# EAGLE design nixie-driver (EAGLE 7.2.0)
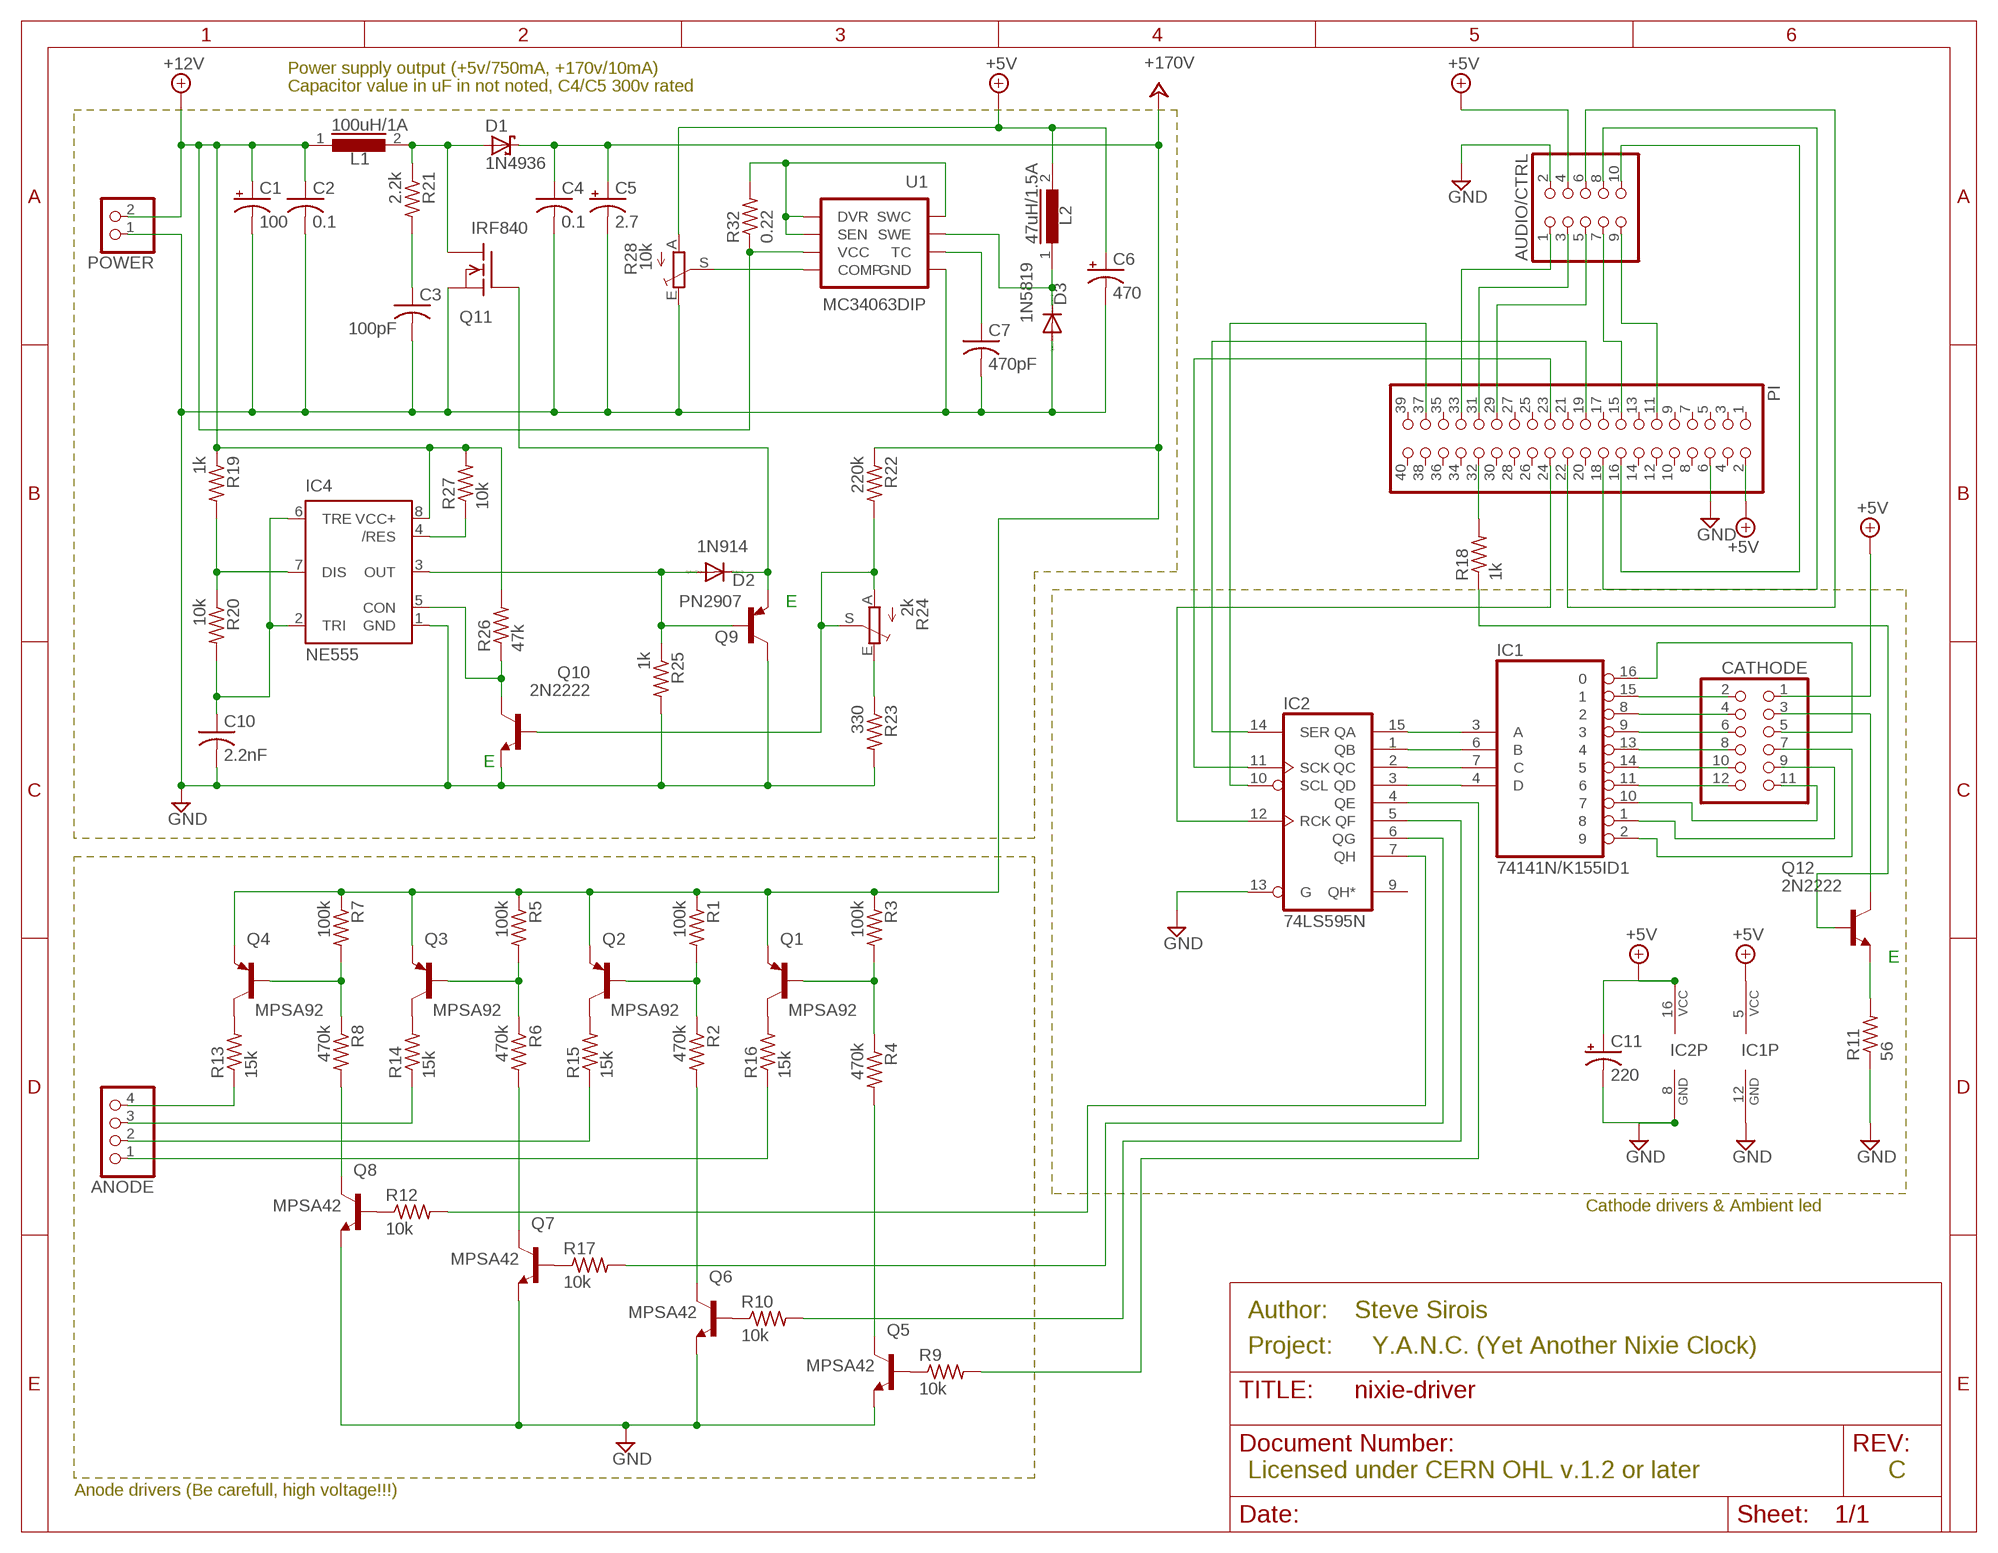
[diagram p0: schematic, sheet 1]

## Parts
ANODE  PINHD-1X4  [1X04]
AUDIO/CTRL  PINHD-2X5  [2X05]
C1  100  CPOL-USE2,5-6E  [E2,5-6E]
C2  0.1  C-US050-024X044  [C050-024X044]
C3  100pF  C-US050-024X044  [C050-024X044]
C4  0.1  C-US150-054X183  [C150-054X183]
C5  2.7  CPOL-USE2.5-7  [E2,5-7]
C6  470  CPOL-USE3.5-8  [E3,5-8]
C7  470pF  C-US050-024X044  [C050-024X044]
C10  2.2nF  C-US025-025X050  [C025-025X050]
C11  220  CPOL-USE3.5-8  [E3,5-8]
CATHODE  PINHD-2X6  [2X06]
D1  1N4936  1N5817-B  [DO41-7.6]
D2  1N914  1N4004  [DO41-10]
D3  1N5819  1N4004  [DO41-10]
IC1  74141N/K155ID1  74141N  [DIL16]
IC2  74LS595N  [DIL16]
IC4  NE555  [DIL-08]
L1  100uH/1A  MMICC7  [MMICC7]
L2  47uH/1.5A  MMICC7  [MMICC7]
PI  PINHD-2X20  [2X20]
POWER  PINHD-1X2  [1X02]
Q1  MPSA92  MPSA92-PNP-TO92-EBC  [TO92-EBC]
Q2  MPSA92  MPSA92-PNP-TO92-EBC  [TO92-EBC]
Q3  MPSA92  MPSA92-PNP-TO92-EBC  [TO92-EBC]
Q4  MPSA92  MPSA92-PNP-TO92-EBC  [TO92-EBC]
Q5  MPSA42  -NPN-TO92-EBC  [TO92-EBC]
Q6  MPSA42  -NPN-TO92-EBC  [TO92-EBC]
Q7  MPSA42  -NPN-TO92-EBC  [TO92-EBC]
Q8  MPSA42  -NPN-TO92-EBC  [TO92-EBC]
Q9  PN2907  2N4126  [TO92-CBE]
Q10  2N2222  2N2222-NPN-TO92-EBC  [TO92-EBC]
Q11  IRF840  [TO220]
Q12  2N2222  2N2222-NPN-TO92-EBC  [TO92-EBC]
R1  100k  R-US_0207/10  [0207/10]
R2  470k  R-US_0207/10  [0207/10]
R3  100k  R-US_0207/10  [0207/10]
R4  470k  R-US_0207/10  [0207/10]
R5  100k  R-US_0207/10  [0207/10]
R6  470k  R-US_0207/10  [0207/10]
R7  100k  R-US_0207/10  [0207/10]
R8  470k  R-US_0207/10  [0207/10]
R9  10k  R-US_0207/10  [0207/10]
R10  10k  R-US_0207/10  [0207/10]
R11  56  R-US_0207/10  [0207/10]
R12  10k  R-US_0207/10  [0207/10]
R13  15k  R-US_0207/10  [0207/10]
R14  15k  R-US_0207/10  [0207/10]
R15  15k  R-US_0207/10  [0207/10]
R16  15k  R-US_0207/10  [0207/10]
R17  10k  R-US_0207/10  [0207/10]
R18  1k  R-US_0207/10  [0207/10]
R19  1k  R-US_0207/10  [0207/10]
R20  10k  R-US_0207/10  [0207/10]
R21  2.2k  R-US_0207/10  [0207/10]
R22  220k  R-US_0207/10  [0207/10]
R23  330  R-US_0207/10  [0207/10]
R24  2k  TRIM_EU-CA6V  [CA6V]
R25  1k  R-US_0207/10  [0207/10]
R26  47k  R-US_0207/10  [0207/10]
R27  10k  R-US_0207/10  [0207/10]
R28  10k  TRIM_EU-CA6V  [CA6V]
R32  0.22  R-US_0204/2V  [0204V]
U1  MC34063DIP  [DIP-08]

## Nets
+5V: AUDIO/CTRL.4 C6.+ C11.+ CATHODE.1 IC1.5(VCC) IC2.16(VCC) L2.2 PI.2 R28.A
+12V: C1.+ C2.1 IC4.8(VCC+) L1.1 POWER.2 R19.1 R26.2 R27.2 R32.1 U1.6(VCC)
+24V: C4.1 C5.+ D1.C Q1.E Q2.E Q3.E Q4.E R1.1 R3.1 R5.1 R7.1 R22.1 ; supply symbol labelled +170V
GND: AUDIO/CTRL.2 C1.- C2.2 C3.2 C4.2 C5.- C6.- C7.2 C10.2 C11.- D3.A IC1.12(GND) IC2.8(GND) IC2.13(G) IC4.1(GND) PI.6 POWER.1 Q5.E Q6.E Q7.E Q8.E Q9.C Q10.E Q11.3(S) R11.1 R23.2 R25.2 R28.E U1.4(GND)
N$1: D1.A L1.2 Q11.2(D) R21.1
N$2: CATHODE.2 IC1.15
N$3: CATHODE.4 IC1.8
N$4: CATHODE.6 IC1.9
N$5: CATHODE.8 IC1.13
N$6: CATHODE.10 IC1.14
N$7: CATHODE.12 IC1.11
N$8: CATHODE.11 IC1.10
N$9: CATHODE.9 IC1.1
N$10: CATHODE.7 IC1.2
N$11: CATHODE.5 IC1.16
N$12: IC1.3(A) IC2.15(QA)
N$13: IC1.6(B) IC2.1(QB)
N$14: IC1.7(C) IC2.2(QC)
N$15: IC1.4(D) IC2.3(QD)
N$16: PI.32 R18.2
N$17: Q4.B R7.2 R8.1
N$18: Q3.B R5.2 R6.1
N$19: Q2.B R1.2 R2.1
N$20: Q1.B R3.2 R4.1
N$21: Q4.C R13.2
N$22: Q3.C R14.2
N$23: Q2.C R15.2
N$24: Q1.C R16.2
N$25: ANODE.4 R13.1
N$26: ANODE.3 R14.1
N$27: ANODE.2 R15.1
N$28: ANODE.1 R16.1
N$29: Q8.C R8.2
N$30: Q8.B R12.1
N$31: Q7.B R17.1
N$32: Q6.B R10.1
N$33: Q5.B R9.1
N$34: Q7.C R6.2
N$35: Q6.C R2.2
N$36: Q5.C R4.2
N$37: IC2.7(QH) R12.2
N$38: IC2.6(QG) R17.2
N$39: IC2.5(QF) R10.2
N$40: IC2.4(QE) R9.2
N$41: IC2.12(RCK) PI.24
N$42: IC2.11(SCK) PI.23
N$43: IC2.14(SER) PI.19
N$44: Q12.E R11.2
N$45: CATHODE.3 Q12.C
N$46: Q12.B R18.1
N$47: AUDIO/CTRL.1 PI.33
N$48: AUDIO/CTRL.3 PI.31
N$49: AUDIO/CTRL.5 PI.29
N$50: AUDIO/CTRL.7 PI.15
N$51: AUDIO/CTRL.9 PI.11
N$52: IC4.7(DIS) R19.2 R20.1
N$53: AUDIO/CTRL.10 PI.16
N$54: AUDIO/CTRL.8 PI.18
N$55: AUDIO/CTRL.6 PI.22
N$56: C3.1 R21.2
N$57: R32.2 U1.1(SWC) U1.7(SEN) U1.8(DVR)
N$58: IC4.4(/RES) R27.1
N$59: D2.A IC4.3(OUT) Q9.B R25.1
N$60: IC4.5(CON) Q10.C R26.1
N$61: R28.S U1.5(COMP)
N$62: D2.C Q9.E Q11.1(G)
N$63: IC2.10(SCL) PI.37
N$64: Q10.B R22.2 R24.A R24.S
N$65: R23.1 R24.E
N$66: C10.1 IC4.2(TRI) IC4.6(TRE) R20.2
N$68: C7.1 U1.3(TC)
N$69: D3.C L2.1 U1.2(SWE)
Unconnected: IC2.9(QH*) PI.1 PI.3 PI.4 PI.5 PI.7 PI.8 PI.9 PI.10 PI.12 PI.13 PI.14 PI.17 PI.20 PI.21 PI.25 PI.26 PI.27 PI.28 PI.30 PI.34 PI.35 PI.36 PI.38 PI.39 PI.40

## Notes on the sheet
- Power supply output (+5v/750mA, +170v/10mA)
- Capacitor value in uF in not noted, C4/C5 300v rated
- E
- E
- E
- Cathode drivers & Ambient led
- Author: | Steve Sirois
- Project: | Y.A.N.C. (Yet Another Nixie Clock)
- Licensed under CERN OHL v.1.2 or later | C
- Anode drivers (Be carefull, high voltage!!!)

## Library data of the parts
ANODE = pinhead:PINHD-1X4: PIN HEADER
AUDIO/CTRL = pinhead:PINHD-2X5: PIN HEADER
C1 C5 C6 C11 = rcl:CPOL-US: POLARIZED CAPACITOR, American symbol
C2-C4 C7 C10 = rcl:C-US: CAPACITOR, American symbol
CATHODE = pinhead:PINHD-2X6: PIN HEADER
D1 = diode:1N581*: 1.0A SCHOTTKY BARRIER RECTIFIER Source: http://www.diodes.com/datasheets/ds23001.pdf
D2 D3 = diode:1N4004: DIODE general purpose rectifier, 1 A
IC1 = 74xx-us:74*141: BCD to decimal DECODER/DRIVER
IC2 = 74xx-us:74*595: 8-bit SHIFT REGISTER, output latch
IC4 = st-microelectronics:NE555: General purpose bipolar Timer; MF: Arrow Electronics; MPN: NE555N; OC_FARNELL: 1467742; OC_NEWARK: 89K1486
L1 L2 = inductors:MMICC7: INDUCTOR
PI = pinhead:PINHD-2X20: PIN HEADER
POWER = pinhead:PINHD-1X2: PIN HEADER
Q1-Q4 = transistor:*-PNP-: PNP Transistror
Q5-Q8 = transistor:*-NPN-: NPN Transistror BF959 corrected 2008.03.06
Q9 = transistor-pnp:2N4126*: PNP Transistror
Q10 Q12 = transistor-neu-to92:*-NPN-: NPN Transistror BF959 corrected 2008.03.06
Q11 = transistor-fet:IRF840: N-Channel Enhancement MOSFET (HEXFET); 500V; 8A; 0,85Ohm
R1-R23 R25-R27 R32 = resistor:R-US_: RESISTOR, American symbol
R24 R28 = pot:TRIM_EU-: POTENTIOMETER
U1 = SparkFun-PowerIC:MC34063: Jellybean switching supply controller

## Board
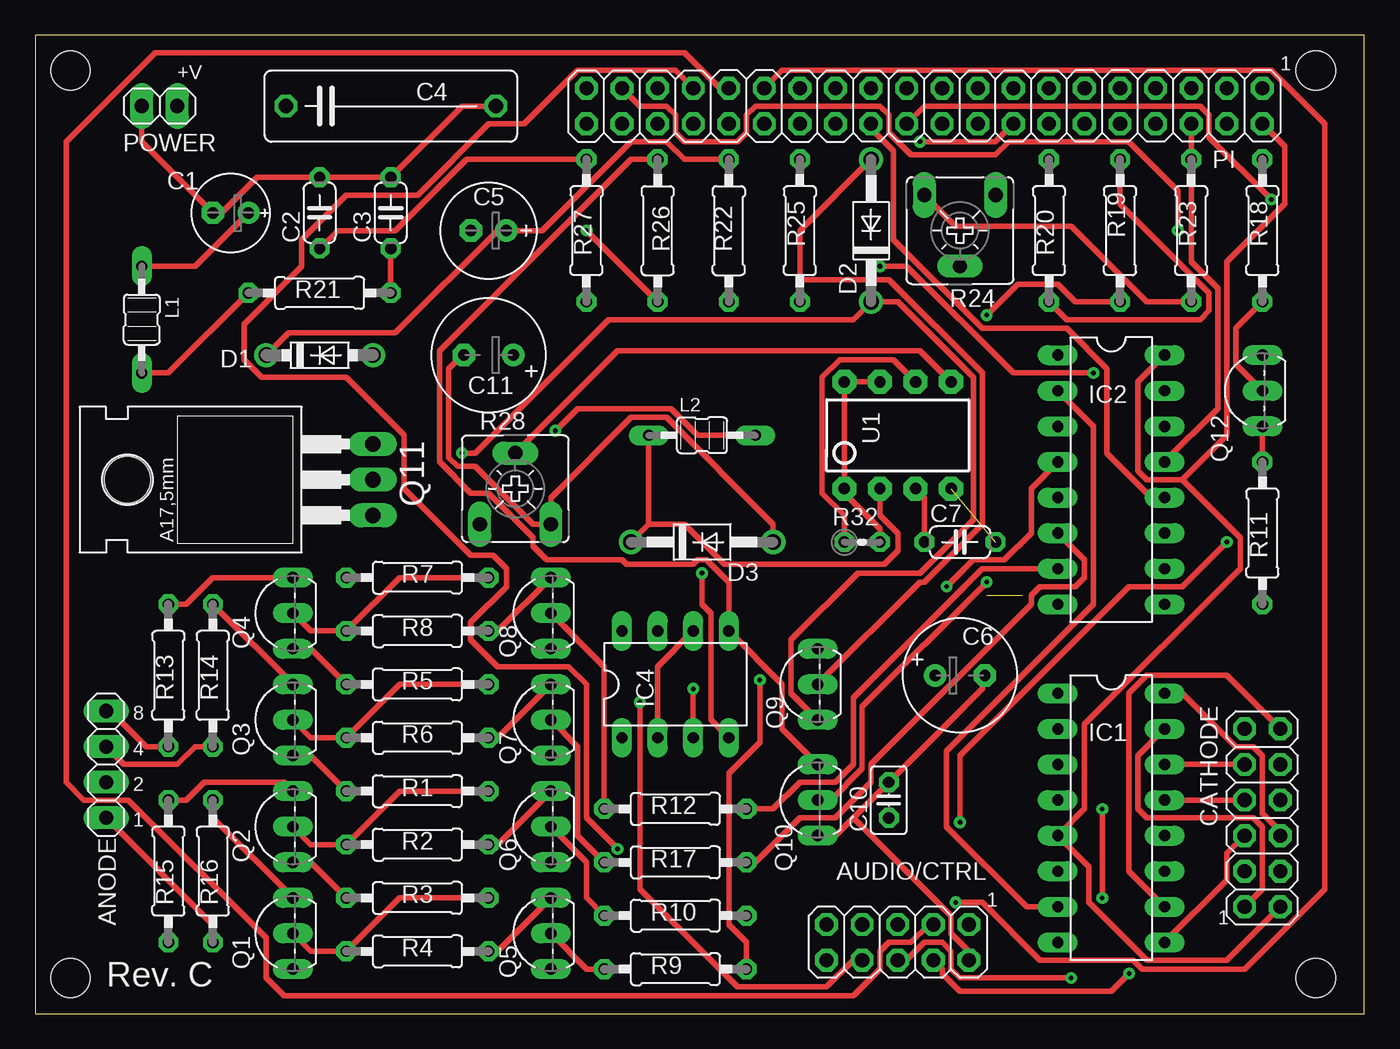
[diagram p1: board, top side]
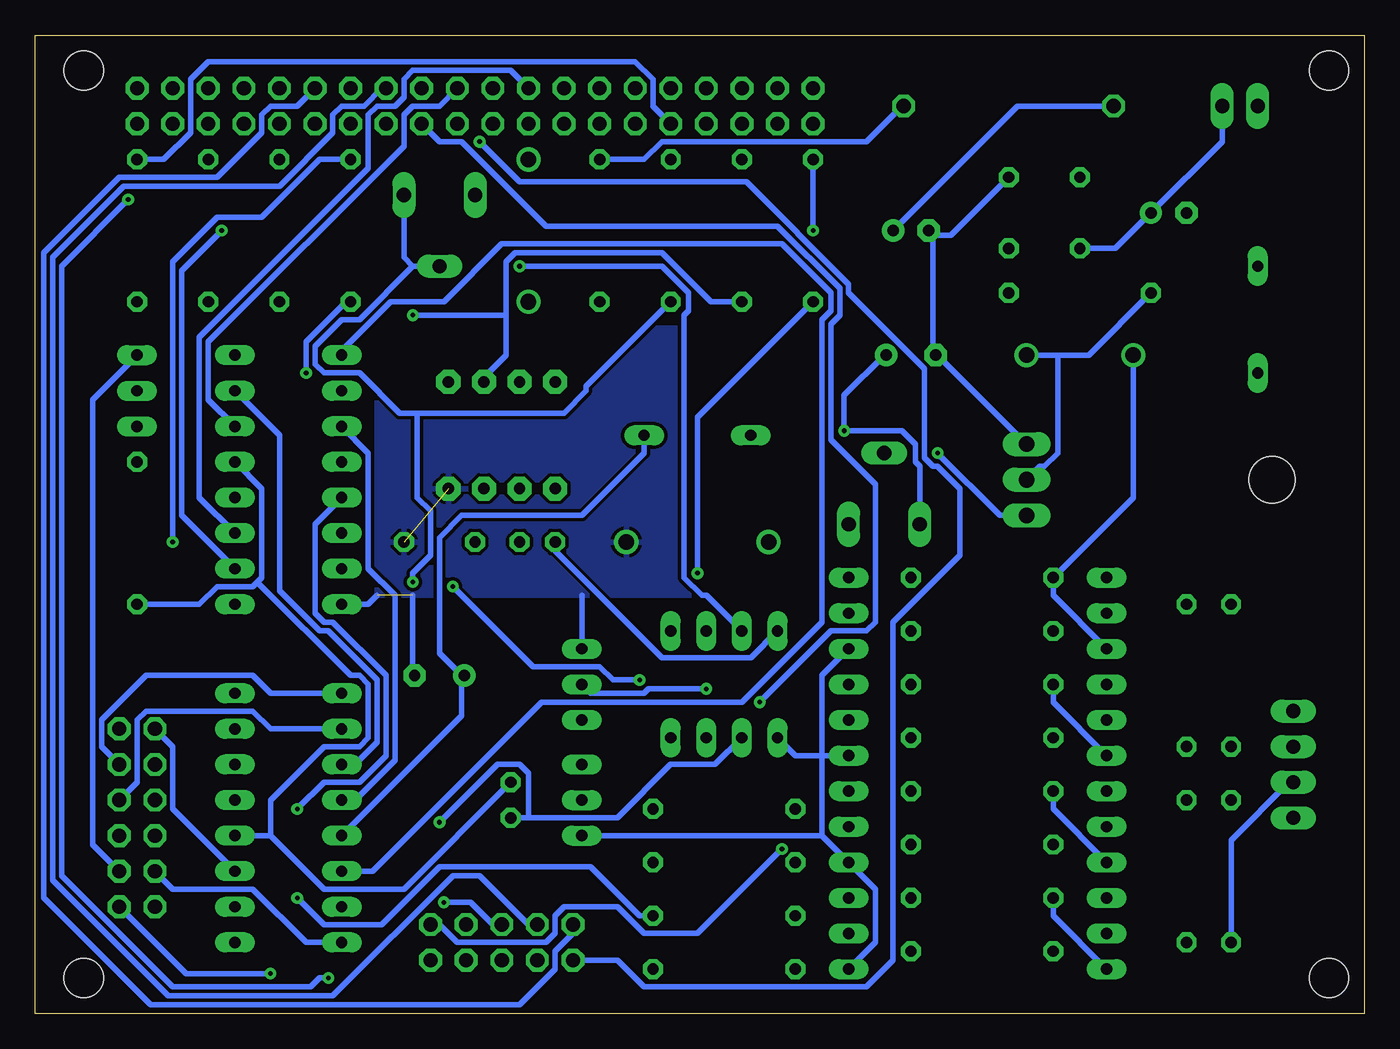
[diagram p2: board, bottom side, seen from below]

Size 94.92 x 69.84 mm. Coordinates in mm from the lower left corner, seen from the top.
Outline: 0,0 94.92,0 94.92,69.84 0,69.84 0,0
Copper layers (1*16): Top 0.0356mm / dielectric 1.5011mm / Bottom 0.0356mm
Design rules "osh *": minimum track width 15mil, minimum drill 13mil, track to track 10mil, track to pad 10mil, pad to pad 6mil, via to via 6mil, smd to smd 6mil, copper to edge 15mil, drill to drill 6mil, minimum pad ring 12mil, minimum via ring 10mil, stop-mask expansion 3mil, vias tented up to drill 0mil, thermal gap 10mil
Holes 2.8 mm at 91.44,2.54 2.54,2.54 91.44,67.31 2.54,67.31
tRestrict: area 2.5,33 to 19.1,43.2

### Footprints (pad centres in the part's own frame; a part is rotated, then mirrored left to right if it is on the bottom)
1X04 = drill 1.016 long: 1 -3.81,0; 2 -1.27,0; 3 1.27,0; 4 3.81,0
2X05 = drill 1.016 octagon: 1 -5.08,-1.27; 2 -5.08,1.27; 3 -2.54,-1.27; 4 -2.54,1.27; 5 0,-1.27; 6 0,1.27; 7 2.54,-1.27; 8 2.54,1.27; 9 5.08,-1.27; 10 5.08,1.27
E2,5-6E = drill 0.813 pad 1.575: + -1.27,0 | drill 0.813 pad 1.575 octagon: - 1.27,0
C050-024X044 = drill 0.813 octagon: 1 -2.54,0; 2 2.54,0
C150-054X183 = drill 1.016 octagon: 1 -7.493,0; 2 7.493,0
E2,5-7 = drill 0.813 pad 1.6: + -1.27,0 | drill 0.813 pad 1.6 octagon: - 1.27,0
E3,5-8 = drill 0.813 pad 1.6: + -1.778,0 | drill 0.813 pad 1.6 octagon: - 1.778,0
C025-025X050 = drill 0.813 octagon: 1 -1.27,0; 2 1.27,0
2X06 = drill 1.016 octagon: 1 -6.35,-1.27; 2 -6.35,1.27; 3 -3.81,-1.27; 4 -3.81,1.27; 5 -1.27,-1.27; 6 -1.27,1.27; 7 1.27,-1.27; 8 1.27,1.27; 9 3.81,-1.27; 10 3.81,1.27; 11 6.35,-1.27; 12 6.35,1.27
DO41-7.6 = drill 1.1 pad 1.7: A 3.81,0; C -3.81,0
DO41-10 = drill 1.118: A 5.08,0; C -5.08,0
DIL16 = drill 0.813 long: 1 -8.89,-3.81; 2 -6.35,-3.81; 3 -3.81,-3.81; 4 -1.27,-3.81; 5 1.27,-3.81; 6 3.81,-3.81; 7 6.35,-3.81; 8 8.89,-3.81; 9 8.89,3.81; 10 6.35,3.81; 11 3.81,3.81; 12 1.27,3.81; 13 -1.27,3.81; 14 -3.81,3.81; 15 -6.35,3.81; 16 -8.89,3.81
DIL-08 = drill 0.813 long: 1 -3.81,-3.81; 2 -1.27,-3.81; 3 1.27,-3.81; 4 3.81,-3.81; 5 3.81,3.81; 6 1.27,3.81; 7 -1.27,3.81; 8 -3.81,3.81
MMICC7 = drill 0.813 long: 1 -3.81,0; 2 3.81,0
2X20 = drill 1.016 octagon: 1 -24.13,-1.27; 2 -24.13,1.27; 3 -21.59,-1.27; 4 -21.59,1.27; 5 -19.05,-1.27; 6 -19.05,1.27; 7 -16.51,-1.27; 8 -16.51,1.27; 9 -13.97,-1.27; 10 -13.97,1.27; 11 -11.43,-1.27; 12 -11.43,1.27; 13 -8.89,-1.27; 14 -8.89,1.27; 15 -6.35,-1.27; 16 -6.35,1.27; 17 -3.81,-1.27; 18 -3.81,1.27; 19 -1.27,-1.27; 20 -1.27,1.27; 21 1.27,-1.27; 22 1.27,1.27; 23 3.81,-1.27; 24 3.81,1.27; 25 6.35,-1.27; 26 6.35,1.27; 27 8.89,-1.27; 28 8.89,1.27; 29 11.43,-1.27; 30 11.43,1.27; 31 13.97,-1.27; 32 13.97,1.27; 33 16.51,-1.27; 34 16.51,1.27; 35 19.05,-1.27; 36 19.05,1.27; 37 21.59,-1.27; 38 21.59,1.27; 39 24.13,-1.27; 40 24.13,1.27
1X02 = drill 1.016 long: 1 -1.27,0; 2 1.27,0
TO92-EBC = drill 0.813 long: B 0,-1.27; C 2.54,-1.27; E -2.54,-1.27
TO92-CBE = drill 0.813 long: B 0,0; C 2.54,0; E -2.54,0
TO220 = drill 1.118 long: 1 -2.54,-6.35; 2 0,-6.35; 3 2.54,-6.35 | hole 3.302: 0,11.176
0207/10 = drill 0.813 octagon: 1 -5.08,0; 2 5.08,0
CA6V = drill 1.016 long: A -2.54,-2.54; E 2.54,-2.54; S 0,2.54
0204V = drill 0.813 octagon: 1 -1.27,0; 2 1.27,0
DIP-08 = drill 0.813 pad 1.727 octagon: 1 -3.81,-3.81; 2 -1.27,-3.81; 3 1.27,-3.81; 4 3.81,-3.81; 5 3.81,3.81; 6 1.27,3.81; 7 -1.27,3.81; 8 -3.81,3.81

### Placement (x,y rotation side)
ANODE  5.08,17.78 90 top
AUDIO/CTRL  61.59,5.08 180 top
C1  13.97,57.15 180 top
C2  20.32,57.15 90 top
C3  25.4,57.15 90 top
C4  25.4,64.77 0 top
C5  32.38,55.88 180 top
C6  66.04,24.13 0 top
C7  66.04,33.66 0 top
C10  60.96,15.24 90 top
C11  32.38,46.99 180 top
CATHODE  87.63,13.97 90 top
D1  20.32,46.99 0 top
D2  59.69,55.88 90 top
D3  47.62,33.66 0 top
IC1  76.83,13.97 270 top
IC2  76.83,38.1 270 top
IC4  45.72,23.5 0 top
L1  7.62,49.53 270 top
L2  47.62,41.27 0 top
PI  63.5,64.77 180 top
POWER  8.89,64.77 0 top
Q1  17.14,5.71 90 top
Q2  17.14,13.34 90 top
Q3  17.14,20.95 90 top
Q4  17.14,28.57 90 top
Q5  35.56,5.71 90 top
Q6  35.56,13.34 90 top
Q7  35.56,20.95 90 top
Q8  35.56,28.57 90 top
Q9  55.88,23.5 90 top
Q10  54.61,15.24 90 top
Q11  17.78,38.1 90 top
Q12  86.36,44.45 90 top
R1  27.3,15.88 0 top
R2  27.3,12.06 0 top
R3  27.3,8.26 0 top
R4  27.3,4.45 0 top
R5  27.3,23.5 0 top
R6  27.3,19.68 0 top
R7  27.3,31.11 0 top
R8  27.3,27.3 0 top
R9  45.72,3.17 0 top
R10  45.72,6.99 0 top
R11  87.63,34.29 90 top
R12  45.72,14.61 0 top
R13  9.53,24.13 90 top
R14  12.7,24.13 90 top
R15  9.53,10.16 90 top
R16  12.7,10.16 90 top
R17  45.72,10.79 0 top
R18  87.63,55.88 90 top
R19  77.47,55.88 90 top
R20  72.39,55.88 90 top
R21  20.32,51.44 0 top
R22  49.53,55.88 270 top
R23  82.55,55.88 90 top
R24  66.04,55.88 180 top
R25  54.61,55.88 90 top
R26  44.45,55.88 270 top
R27  39.37,55.88 90 top
R28  34.29,37.47 0 top
R32  59.05,33.66 0 top
U1  61.59,41.27 0 top

### Tracks (layer width: path | path; a pad name or v marks a point on that pad's centre or on a via)
+5V  (via drill 0.33)
  Top 0.381: L2.2 47.31,41.27 45.4,43.18 38.73,43.18 v37.15,41.59 | IC2.16 78.74,45.09 78.74,38.73 79.38,38.1 81.92,38.1 | 81.92,38.1 85.09,41.27 85.09,53.66 89.22,57.78 89.22,61.91 PI.2 | AUDIO/CTRL.4 64.77,3.17 64.77,2.86 66.04,1.59 76.83,1.59 v78.11,2.86 | CATHODE.1 85.09,3.81 79.38,3.81 75.25,7.94 75.25,10.48 IC1.5 74.93,14.61 74.93,20.64 86.04,31.75 86.04,33.97 81.92,38.1
  Bottom 0.381: C11.+ 34.29,46.99 37.15,44.13 v37.15,41.59 33.02,41.59 32.07,40.64 32.07,39.37 31.75,39.05 R28.A | IC1.5 64.45,21.27 64.45,24.13 | v78.11,2.86 84.14,2.86 CATHODE.1 | L2.2 51.44,40.01 55.88,35.56 64.45,35.56 66.04,33.97 66.04,25.72 64.45,24.13 | 64.45,24.13 C6.+
+12V  (via drill 0.33)
  Top 0.381: L1.1 11.43,53.34 C1.+ | R27.2 30.8,60.96 25.72,55.88 21.59,55.88 C2.1 | R19.1 74.3,50.8 73.03,52.07 70.17,52.07 v67.94,49.85 | R32.1 57.78,35.56 56.2,37.15 56.2,45.4 57.47,46.67 61.28,46.67 U1.6 | R26.2 v39.37,55.88
  Bottom 0.381: C2.1 17.78,54.61 C1.+ 10.16,62.23 POWER.2 | IC4.8 43.81,25.4 50.16,25.4 57.78,33.02 R32.1 | R26.2 46.67,50.8 50.16,54.29 60.64,54.29 61.28,53.66 61.28,49.85 | 61.28,49.85 61.28,46.99 62.87,45.4 U1.6 | 61.28,49.85 v67.94,49.85 | v39.37,55.88 R27.2
+24V
  Top 0.381: R22.1 46.35,60.96 45.09,62.23 42.55,62.23 36.2,55.88 C5.+ 33.02,55.88 25.72,48.58 18.1,48.58 D1.C | Q3.E 19.68,18.41 R1.1 | Q2.E 19.68,10.79 R3.1 | Q4.E 19.68,26.04 R5.1
  Bottom 0.381: C4.1 24.77,64.77 C5.+ | Q1.E 22.23,6.99 R3.1 | R1.1 22.23,14.61 Q2.E | Q4.E 22.23,29.84 R7.1 16.51,36.83 D1.C | Q3.E 22.23,22.23 R5.1
GND  (2 unrouted)
  Top 0.381: C11.- 30.48,46.99 29.53,46.04 29.53,39.69 30.16,39.05 31.43,39.05 35.56,34.92 R28.E 36.83,36.83 42.55,42.55 45.09,42.55 52.7,34.92 D3.A | POWER.1 7.62,62.23 C1.- 13.34,57.15 15.88,59.69 C2.2 C3.2 30.48,64.77 C4.2 | PI.6 R23.2 82.55,53.66 84.45,51.75 84.45,43.18 IC2.13 | Q10.E 57.15,12.7 58.42,13.97 | 58.42,13.97 C10.2 67.63,23.18 67.63,24.13 C6.- | AUDIO/CTRL.2 66.67,4.45 65.41,5.71 65.41,6.99 58.42,13.97
  Bottom 0.381: 30.8,55.56 30.8,46.99 C11.- 30.48,46.99 Q11.3 | R25.2 51.44,60.96 50.16,62.23 35.56,62.23 33.02,64.77 C4.2 | 30.8,55.56 29.53,55.56 C3.2 | 30.8,55.56 C5.- | R11.1 83.19,29.21 81.92,30.48 79.38,30.48 79.06,30.8 | 79.06,30.8 78.74,31.11 78.74,37.47 IC2.13 | Q5.E 34.92,5.08 34.92,8.89 Q6.E 38.73,12.7 | 38.73,18.41 40.64,18.41 IC4.1 | 38.73,18.41 Q7.E | Q8.E 38.73,24.13 38.73,18.41 | 38.73,18.41 38.73,12.7 | 55.88,29.84 Q9.C | IC2.8 71.12,29.21 70.48,29.84 | 67.94,29.84 67.94,24.13 C6.- | 78.11,12.7 IC1.12 | 78.11,12.7 74.3,8.89 68.58,8.89 C10.2 | Q10.E 38.73,12.7 | 79.06,30.8 72.39,24.13 71.75,24.13 71.12,23.5 71.12,19.68 71.75,19.05 74.3,19.05 78.11,15.24 78.11,12.7
  pour Bottom: 40.01,48.9 70.48,48.9 70.48,29.84 40.01,29.84
N$1
  Top 0.381: L1.2 9.53,45.72 R21.1
  Bottom 0.381: 21.91,46.99 19.68,46.99 R21.1 | 21.91,46.99 D1.A | Q11.2 23.18,39.05 22.86,39.05 21.91,40.01 21.91,46.99
N$2
  Top 0.381: IC1.15 78.74,18.41 78.74,14.61 79.38,13.97 87,13.97 87.63,13.34 87.63,8.89 CATHODE.2
N$3
  Bottom 0.381: IC1.8 75.56,5.08 79.38,8.89 85.09,8.89 CATHODE.4
N$4
  Top 0.381: IC1.9 85.09,9.53 85.09,11.43 CATHODE.6
N$5
  Top 0.381: CATHODE.8 IC1.13
N$6
  Top 0.381: CATHODE.10 IC1.14
N$7
  Bottom 0.381: IC1.11 85.09,14.61 85.09,19.05 CATHODE.12
N$8
  Top 0.381: IC1.10 78.11,10.16 78.11,22.86 79.38,24.13 85.09,24.13 CATHODE.11
N$9
  Bottom 0.381: IC1.1 78.11,22.86 79.38,24.13 87,24.13 90.17,20.95 90.17,19.05 CATHODE.9
N$10
  Bottom 0.381: IC1.2 78.11,20.32 79.38,21.59 87,21.59 87.63,20.95 87.63,16.51 CATHODE.7
N$11
  Top 0.381: IC1.16 81.92,22.86 85.72,19.05 87,19.05 87.63,18.41 87.63,14.29 88.9,13.02 CATHODE.5
N$12
  Bottom 0.381: IC1.3 72.07,17.78 70.48,19.37 70.48,23.81 73.98,27.3 74.61,27.3 77.47,30.16 77.47,41.27 IC2.15
N$13
  Bottom 0.381: IC1.6 70.8,10.16 58.74,22.23 44.45,22.23 38.73,27.94 38.73,49.53 38.1,50.16 38.1,51.44 41.59,54.93 61.59,54.93 65.72,50.8 69.53,50.8 73.03,47.31 IC2.1
N$14
  Top 0.381: IC1.7 70.8,7.62 65.09,13.34 65.09,18.73 75.56,29.21 75.56,41.91 IC2.2
N$15
  Bottom 0.381: IC1.4 72.07,15.24 69.22,18.1 69.22,29.84 71.12,31.75 71.12,40.01 IC2.3
N$16
  Bottom 0.381: R18.2 85.72,60.96 83.82,62.87 83.82,66.67 82.55,67.94 52.07,67.94 50.8,66.67 50.8,64.77 PI.32
N$17
  Top 0.381: Q4.B 19.68,27.3 R8.1 26.04,31.11 R7.2
N$18
  Top 0.381: Q3.B 19.68,19.68 R6.1 26.04,23.5 R5.2
N$19
  Top 0.381: Q2.B 19.68,12.06 R2.1 26.04,15.88 R1.2
N$20
  Top 0.381: Q1.B 19.68,4.45 R4.1 26.04,8.26 R3.2
N$21
  Top 0.381: R13.2 10.79,29.21 12.7,31.11 Q4.C
N$22
  Top 0.381: Q3.C R14.2
N$23
  Top 0.381: R15.2 10.79,15.24 12.06,16.51 17.78,16.51 Q2.C
N$24
  Top 0.381: R16.2 12.7,13.97 Q1.C
N$25
  Top 0.381: R13.1 7.94,19.05 5.4,21.59 ANODE.4
N$26
  Top 0.381: R14.1 11.43,19.05 10.16,17.78 6.35,17.78 ANODE.3
N$27
  Bottom 0.381: R15.1 9.53,12.38 5.4,16.51 ANODE.2
N$28
  Top 0.381: R16.1 12.7,6.35 ANODE.1
N$29
  Top 0.381: R8.2 33.02,27.3 Q8.C
N$30
  Top 0.381: Q8.B 40.64,24.77 R12.1
N$31
  Top 0.381: Q7.B 38.73,19.05 38.73,12.7 R17.1
N$32
  Top 0.381: Q6.B 39.37,10.79 39.37,8.26 R10.1
N$33
  Top 0.381: R9.1 39.37,3.17 Q5.B
N$34
  Top 0.381: R6.2 33.02,19.68 Q7.C
N$35
  Top 0.381: R2.2 33.02,12.06 Q6.C
N$36
  Top 0.381: R4.2 33.02,4.45 Q5.C
N$37
  Top 0.381: R12.2 52.7,14.61 54.61,16.51 57.15,16.51 58.42,17.78 58.42,22.54 67.63,31.75 IC2.7
N$38
  Top 0.381: R17.2 51.44,10.79 54.61,13.97 57.15,13.97 59.69,16.51 59.69,17.78 71.12,29.21 71.12,29.84 71.75,30.48 74.3,30.48 74.93,31.11 74.93,32.38 IC2.6
N$39  (via drill 0.33)
  Top 0.381: v76.2,14.61 v76.2,8.26
  Bottom 0.381: R10.2 51.75,6.99 55.24,10.48 66.04,10.48 70.17,6.35 74.3,6.35 v76.2,8.26 | v76.2,14.61 74.3,16.51 71.75,16.51 69.85,18.41 69.85,24.13 73.66,27.94 74.3,27.94 74.93,28.57 74.93,34.92 IC2.5
N$40  (via drill 0.33)
  Top 0.381: R9.2 50.8,5.08 49.53,6.35 49.53,17.14 51.75,19.37 v51.75,23.81 | v65.09,30.48 66.99,32.38 69.22,32.38 71.12,34.29 71.12,37.47 IC2.4
  Bottom 0.381: v51.75,23.81 53.66,23.81 54.61,24.77 59.37,24.77 v65.09,30.48
N$41
  Top 0.381: IC2.12 79.69,36.83 76.52,40.01 76.52,46.04 73.66,48.9 67.63,48.9 61.28,55.24 61.28,61.59 59.69,63.18 PI.24
N$42
  Bottom 0.381: IC2.11 83.19,36.83 83.19,48.26 71.12,60.33 71.12,64.14 70.48,64.77 69.22,64.77 68.58,65.41 68.58,66.67 67.94,67.31 60.96,67.31 PI.23
N$43
  Bottom 0.381: IC2.14 82.55,43.81 82.55,47.94 68.58,61.91 68.58,64.14 67.94,64.77 66.04,64.77 PI.19
N$44
  Top 0.381: Q12.E R11.2
N$45
  Bottom 0.381: Q12.C 90.81,43.81 90.81,12.06 CATHODE.3
N$46
  Top 0.381: Q12.B 85.72,46.35 85.72,48.9 R18.1
N$47  (via drill 0.33)
  Top 0.381: v41.59,11.75 39.37,13.97 39.37,23.5 38.1,24.77 33.02,24.77 31.11,26.67 31.11,27.94 33.66,30.48 33.66,31.75 32.7,32.7 31.11,32.7 26.35,37.47 26.35,41.27 22.23,45.4 16.19,45.4 14.92,46.67 14.92,49.21 19.05,53.34 19.05,55.24 22.23,58.42 27.3,58.42 32.38,63.5 34.92,63.5 38.73,67.31 45.72,67.31 PI.33
  Bottom 0.381: AUDIO/CTRL.1 66.04,6.35 64.77,5.08 58.42,5.08 57.78,5.71 57.78,6.99 57.15,7.62 53.34,7.62 51.44,5.71 47.62,5.71 v41.59,11.75
N$48
  Top 0.381: PI.31 48.9,66.04 46.35,68.58 8.57,68.58 2.22,62.23 2.22,16.51 3.49,15.24 6.67,15.24 16.51,5.4 16.51,2.54 17.78,1.27 58.42,1.27 60.33,3.17 60.33,4.45 60.96,5.08 62.55,5.08 63.82,6.35 AUDIO/CTRL.3
N$49  (via drill 0.33)
  Top 0.381: v65.72,7.94 67.63,7.94 71.75,3.81 78.42,3.81 79.06,3.17 86.36,3.17 92.08,8.89 92.08,63.5 88.27,67.31 53.34,67.31 PI.29
  Bottom 0.381: AUDIO/CTRL.5 62.23,6.35 63.82,7.94 v65.72,7.94
N$50
  Bottom 0.381: AUDIO/CTRL.7 59.69,6.35 63.18,9.84 65.09,9.84 73.66,1.27 85.41,1.27 93.66,9.53 93.66,53.98 88.58,59.05 77.47,59.05 73.66,62.87 73.66,64.14 73.03,64.77 71.44,64.77 70.17,66.04 PI.15
N$51
  Bottom 0.381: AUDIO/CTRL.9 56.52,5.71 57.78,4.45 57.78,3.17 60.33,0.64 86.68,0.64 94.3,8.26 94.3,54.29 88.9,59.69 81.92,59.69 78.74,62.87 78.74,64.14 78.11,64.77 76.2,64.77 PI.11
N$52  (via drill 0.33)
  Top 0.381: v60.33,53.34 62.23,53.34 69.85,45.72 v75.56,45.72 | R19.2 77.47,57.78 83.82,51.44 83.82,50.16 83.19,49.53 73.66,49.53 R20.1
  Bottom 0.381: IC4.7 46.99,29.84 47.31,29.84 48.58,31.11 48.58,49.85 48.26,50.16 48.26,51.44 50.16,53.34 v60.33,53.34 | v75.56,45.72 75.56,47.94 72.71,50.8 R20.1
N$53  (via drill 0.33)
  Top 0.381: v63.18,62.23 68.58,62.23 PI.16
  Bottom 0.381: AUDIO/CTRL.10 53.34,3.81 51.44,1.91 35.56,1.91 33.66,3.81 33.66,27.94 28.89,32.7 28.89,37.47 30.48,39.05 30.8,39.05 31.43,39.69 31.43,46.04 36.83,51.44 36.83,52.07 44.13,59.37 60.33,59.37 v63.18,62.23
N$54  (via drill 0.33)
  Top 0.381: AUDIO/CTRL.8 58.42,3.81 56.52,1.91 50.16,1.91 43.18,8.89 v43.18,22.23
  Bottom 0.381: v43.18,22.23 38.1,27.3 35.56,27.3 34.92,27.94 34.92,37.78 38.1,40.96 38.1,49.21 37.47,49.85 37.47,51.75 41.91,56.2 58.42,56.2 64.45,62.23 66.04,62.23 PI.18
N$55  (via drill 0.33)
  Top 0.381: AUDIO/CTRL.6 62.23,3.81 63.5,5.08 64.77,5.08 65.41,4.45 65.41,3.17 66.04,2.54 v73.98,2.54 | v88.27,58.1 83.82,62.55 83.82,64.14 83.19,64.77 63.5,64.77 PI.22
  Bottom 0.381: v73.98,2.54 74.61,2.54 75.25,1.91 85.09,1.91 93.03,9.84 93.03,53.34 v88.27,58.1
N$56
  Top 0.381: C3.1 R21.2
N$57
  Top 0.381: U1.7 U1.8 U1.1 57.78,37.15 60.33,34.61 R32.2
N$58  (via drill 0.33)
  Top 0.381: v47.62,31.43 47.62,29.21 48.26,28.57 48.26,20.95 IC4.4
  Bottom 0.381: R27.1 47.62,42.55 v47.62,31.43
N$59  (via drill 0.33)
  Top 0.381: v46.99,23.18 IC4.3 | 54.61,52.39 54.61,55.88 D2.A | 54.61,52.39 R25.1 | Q9.B 63.18,30.8 63.5,30.8 67.63,34.92 67.63,45.72 60.96,52.39 54.61,52.39
  Bottom 0.381: v46.99,23.18 51.12,23.18 51.44,22.86 55.24,22.86 Q9.B
N$60
  Top 0.381: Q10.C 53.34,20.32 53.34,23.5 IC4.5 49.53,30.8 47.94,32.38 47.31,32.38 46.99,32.07 42.23,32.07 41.91,32.38 36.51,32.38 35.56,33.34 35.56,33.97 32.38,37.15 31.11,37.15 28.89,39.37 28.89,47.31 42.55,60.96 R26.1
N$61
  Top 0.381: R28.S 41.59,47.31 63.18,47.31 U1.5
N$62  (via drill 0.33)
  Top 0.381: Q9.E 53.98,22.86 53.98,26.67 58.74,31.43 63.18,31.43 66.99,35.24 66.99,45.4 61.59,50.8 D2.C 58.42,49.53 40.96,49.53 31.43,40.01 v30.48,40.01
  Bottom 0.381: Q11.1 26.04,35.56 v30.48,40.01
N$63  (via drill 0.33)
  Top 0.381: v81.6,55.88 81.6,58.74 78.11,62.23 69.53,62.23 68.58,61.28 62.55,61.28 60.96,62.87 60.96,64.14 60.33,64.77 51.44,64.77 50.8,64.14 50.8,62.87 50.16,62.23 46.35,62.23 45.72,62.87 45.72,64.14 45.09,64.77 43.18,64.77 PI.37
  Bottom 0.381: IC2.10 84.45,35.56 84.45,53.02 v81.6,55.88
N$64  (via drill 0.33)
  Top 0.381: Q10.B 56.83,15.24 59.05,17.46 59.05,21.91 v67.94,30.8
  Bottom 0.381: R22.2 55.56,44.77 55.56,44.45 57.15,42.86 67.63,42.86 | 67.63,42.86 68.9,42.86 71.75,45.72 74.3,45.72 74.93,46.35 74.93,47.62 73.03,49.53 71.75,49.53 67.94,53.34 | R24.S 67.94,53.34 | v67.94,30.8 67.94,31.43 66.67,32.7 66.67,35.88 67.63,36.83 67.63,42.86 | R24.A 68.58,53.98 67.94,53.34
N$65
  Top 0.381: R23.1 79.38,50.8 73.98,56.2 65.72,56.2 R24.E
N$66  (via drill 0.33)
  Top 0.381: IC4.2 44.45,24.77 IC4.6 | v85.09,33.66 81.92,30.48 78.11,30.48 66.04,18.41 v66.04,13.65
  Bottom 0.381: 59.69,13.97 53.34,13.97 49.53,17.78 46.35,17.78 IC4.2 | 59.69,13.97 C10.1 | R20.2 74.61,60.96 78.74,56.83 81.92,56.83 85.09,53.66 v85.09,33.66 | v66.04,13.65 61.91,17.78 60.33,17.78 59.69,17.14 59.69,13.97
N$68
  Top 0.381: C7.1 63.5,36.83 U1.3
N$69
  Top 0.381: 43.81,34.92 L2.1 | D3.C 43.81,34.92 | U1.2 60.33,35.56 61.59,34.29 61.59,33.02 60.64,32.07 49.21,32.07 46.35,34.92 43.81,34.92

### Text on the board
tPlace: +V | 1 | 8 | 4 | 2 | 1 | 1 | 1 | Rev. C